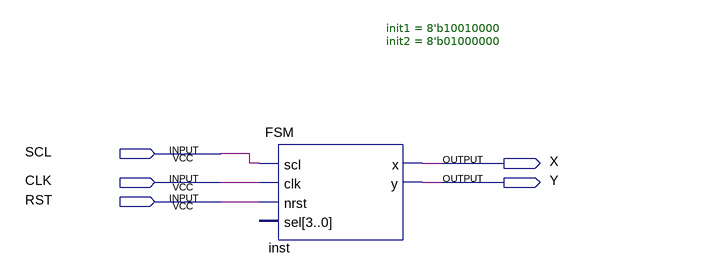
[diagram p0: schematic sheet]
// Quartus schematic Block2.bdf as structural Verilog: 1 symbols, 5 pins
module Block2 (
  input  SCL,
  input  CLK,
  input  RST,
  output X,
  output Y
);

  FSM #(.init1(8'b10010000), .init2(8'b01000000)) inst (.scl(SCL), .clk(CLK), .nrst(RST), .x(X), .y(Y));  // open: sel
endmodule
